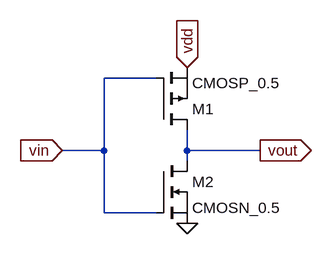
[diagram p0: schematic s_inv.asc]
s_inv.asc, the LTspice schematic file:
Version 4
SHEET 1 880 680
WIRE 128 -112 48 -112
WIRE 48 0 48 -112
WIRE 48 0 -16 0
WIRE 176 0 176 -32
WIRE 288 0 176 0
WIRE 176 16 176 0
WIRE 48 96 48 0
WIRE 128 96 48 96
FLAG 288 0 vout
IOPIN 288 0 Out
FLAG -16 0 vin
IOPIN -16 0 In
FLAG 176 -128 vdd
IOPIN 176 -128 In
FLAG 176 112 0
SYMBOL pmos 128 -32 M180
SYMATTR InstName M1
SYMATTR Value CMOSP_0.5
SYMBOL nmos 128 16 R0
SYMATTR InstName M2
SYMATTR Value CMOSN_0.5

The netlist it stands for:
* s_inv.asc
M1 vout vin vdd vdd CMOSP_0.5
M2 vout vin 0 0 CMOSN_0.5
.model NMOS NMOS
.model PMOS PMOS
.lib standard.mos
.backanno
.end